# EasyEDA Pro project DCDC.eprj, board Boost
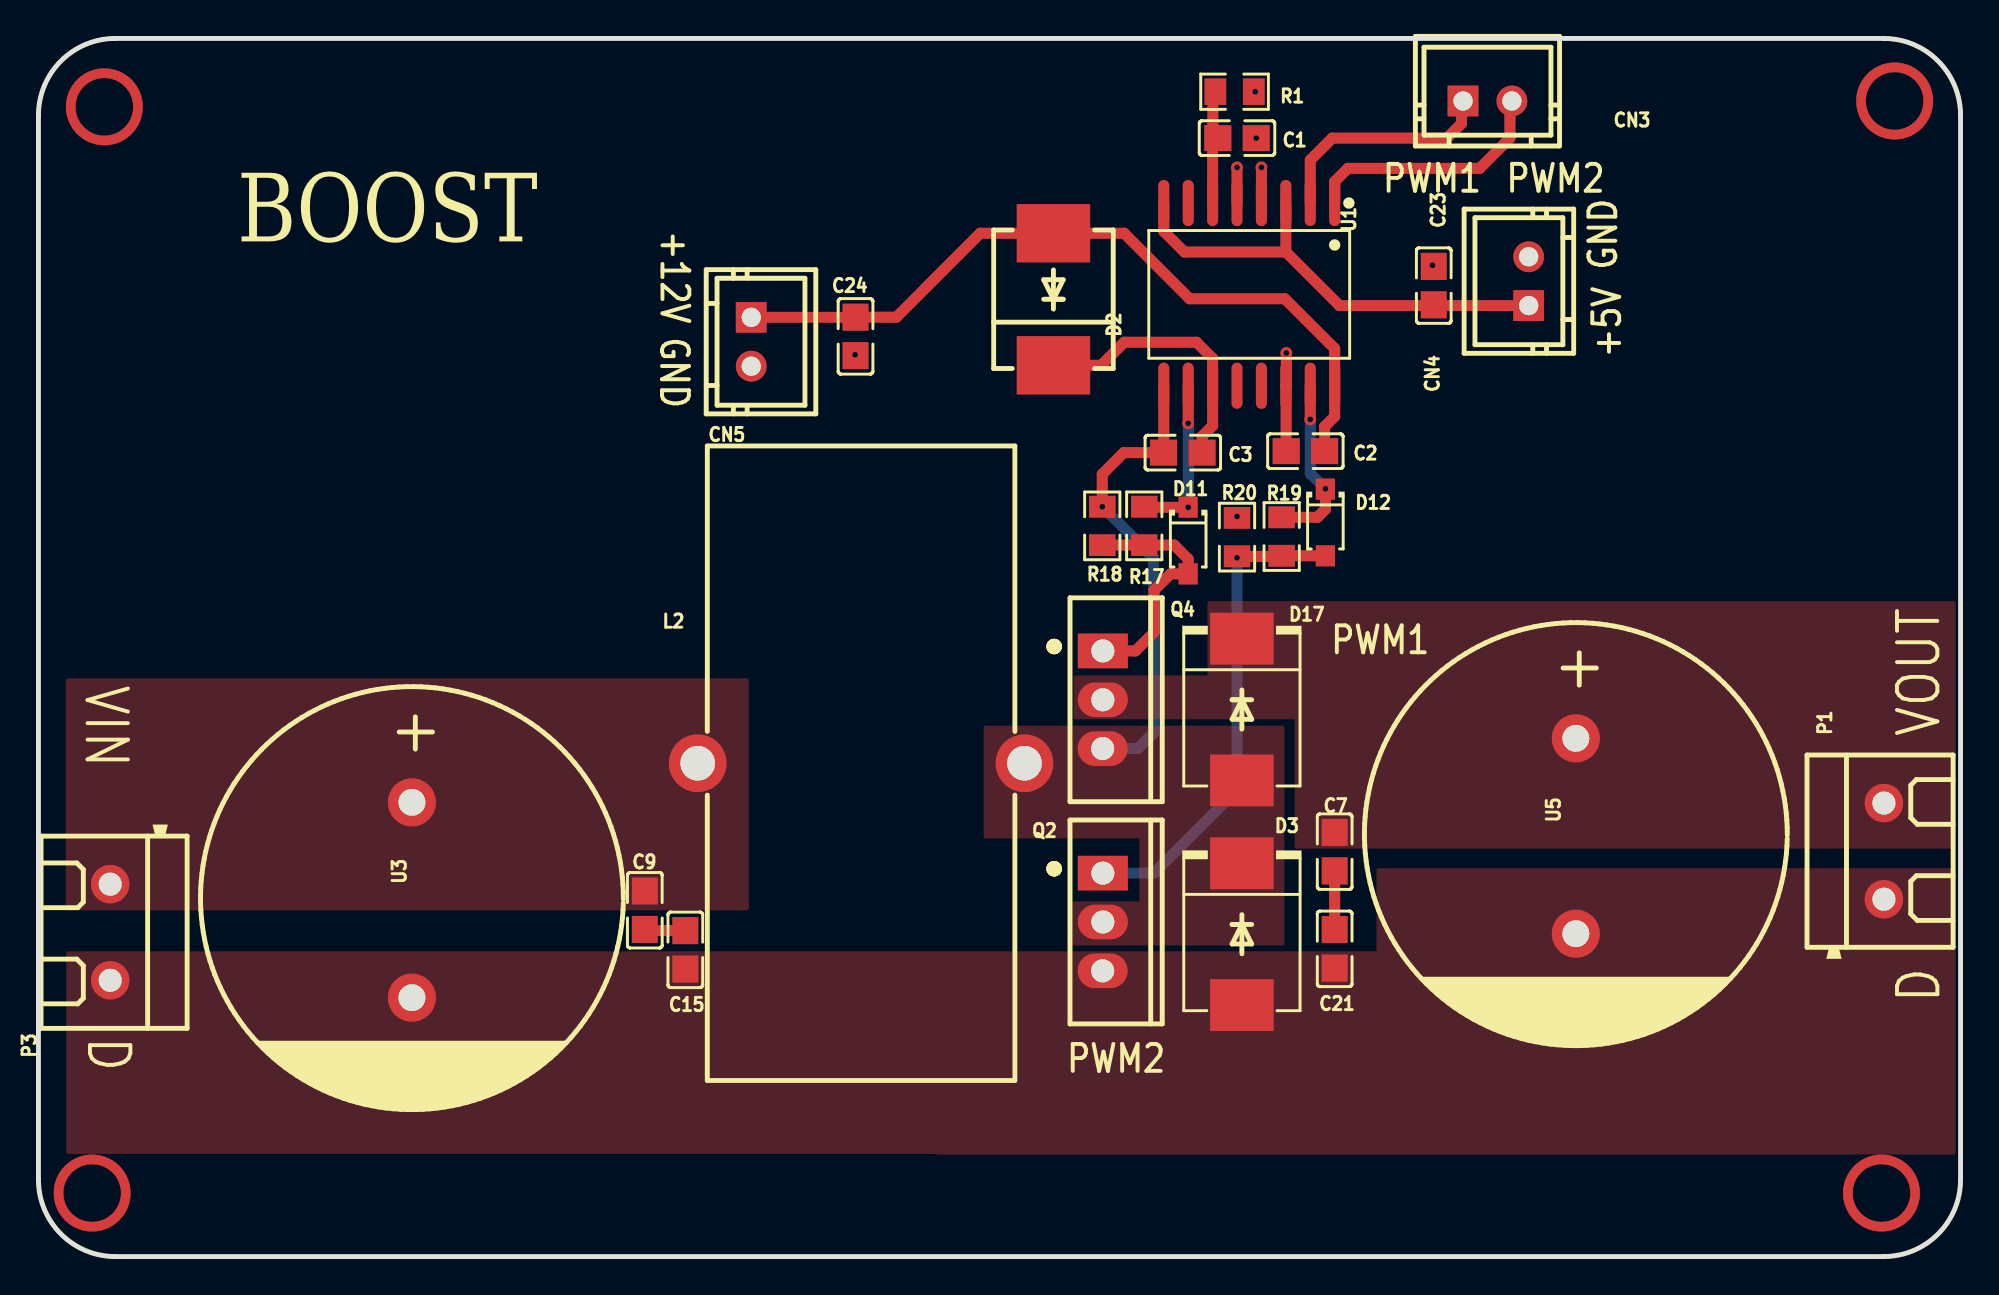
[diagram p10: board, top side]
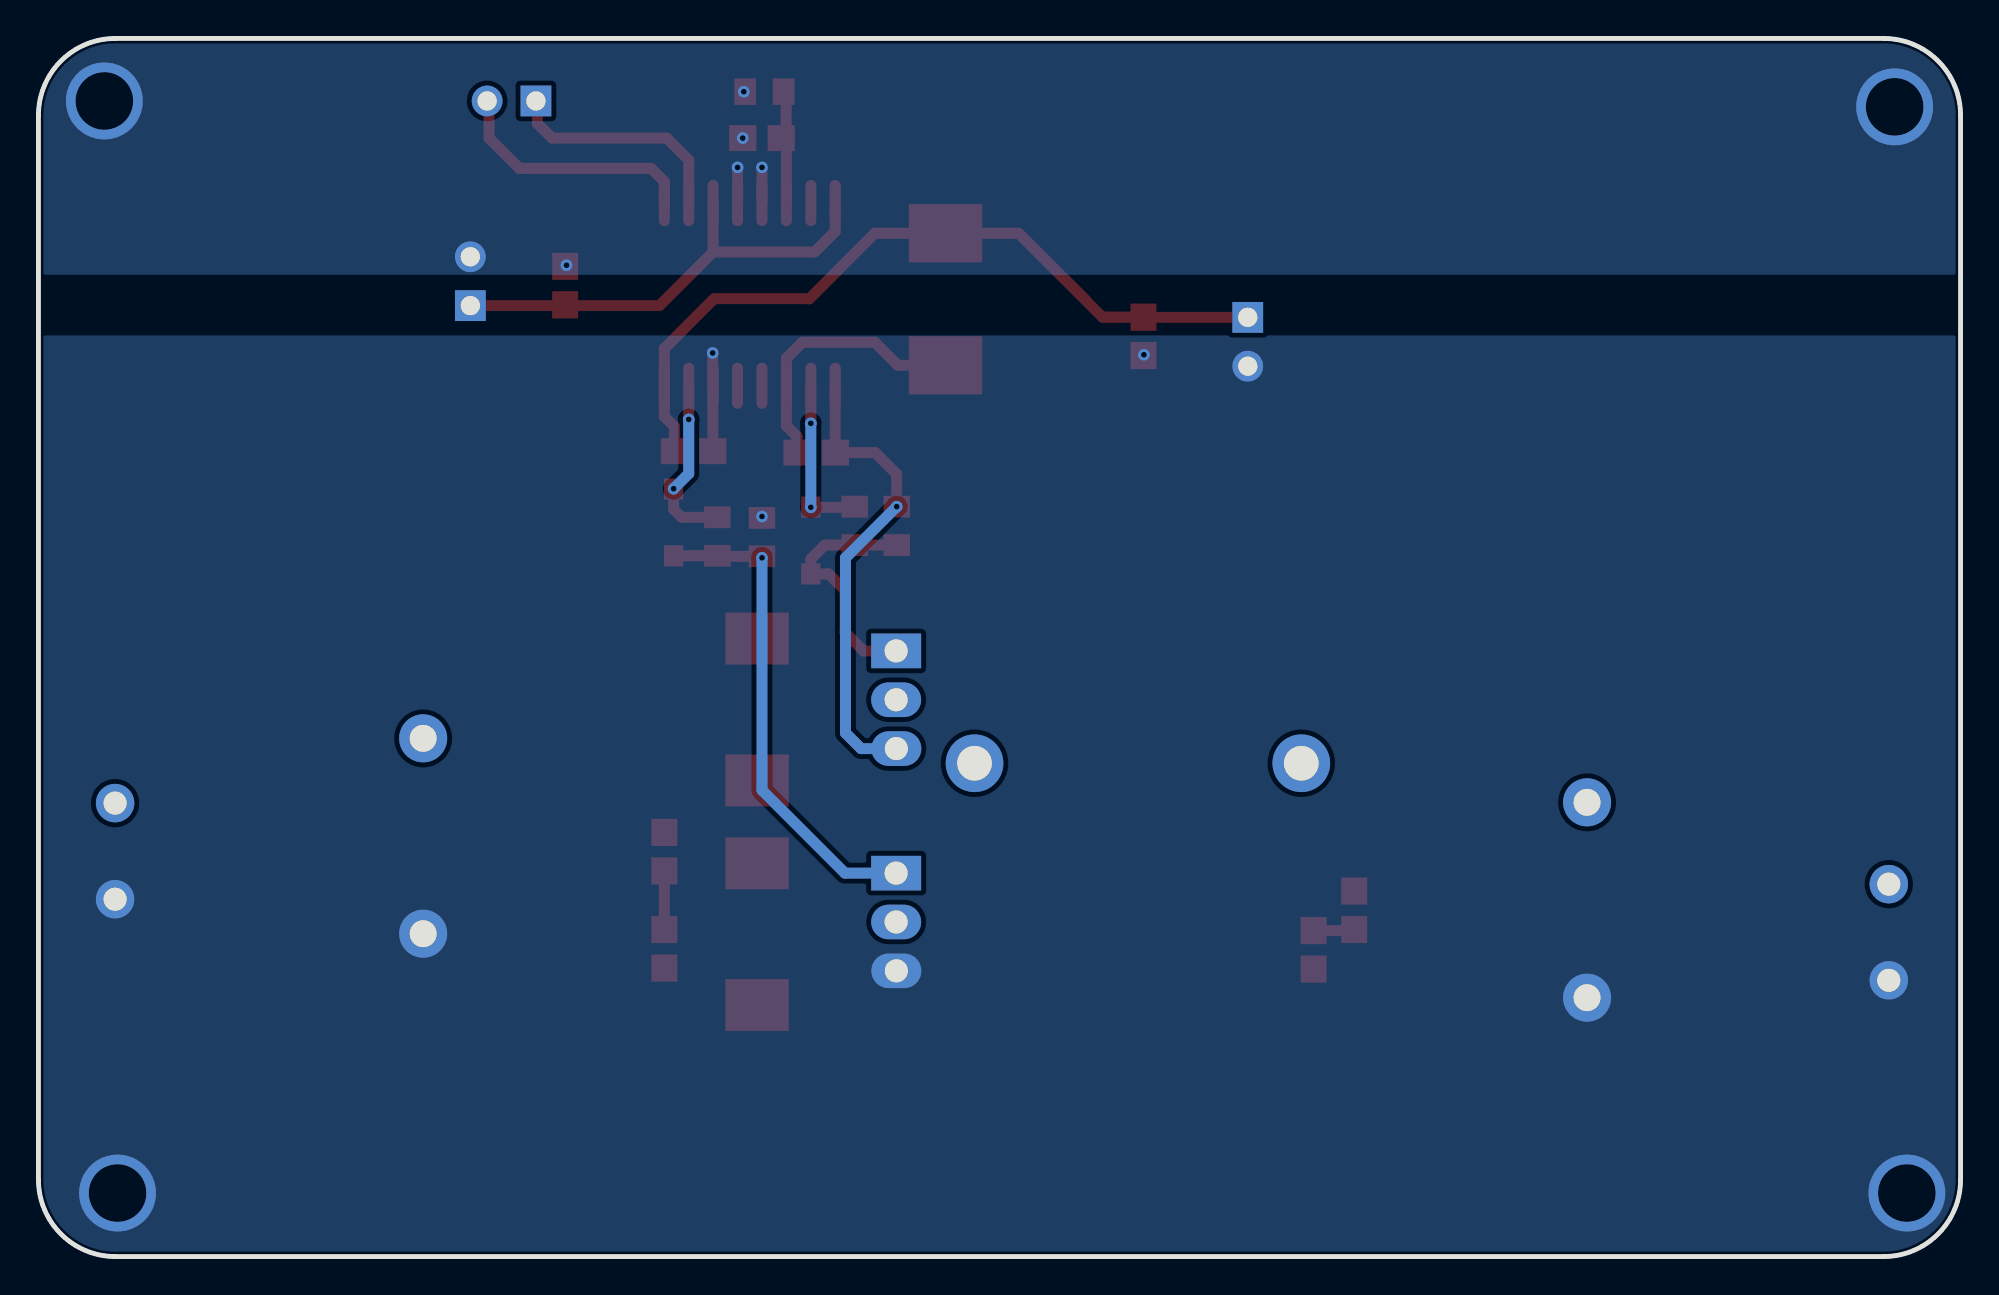
[diagram p11: board, bottom side, seen from below]

Outline 100 x 63.35 mm; copper layers: Top Layer, Bottom Layer. Coordinates in mm from the lower left corner of the outline.
Outline path: 0,59.35 0,4 arc(1.17,1.17) 4,0 96,0 arc(98.83,1.17) 100,4 100,59.35 arc(98.83,62.18) 96,63.35 4,63.35 arc(1.17,62.18) 0,59.35
Stack: Top Layer 0.035mm / Dielectric1 1.51mm FR4 er 4.5 / Bottom Layer 0.035mm

## Design rules (mm)
template: 自定义配置
spacing copperThickness1oz (default): track to track 0.102, other pairs 0.152 to 0.3
spacing copperThickness2oz: track to track 0.203, other pairs 0.152 to 0.3
track width copperThickness1oz (default): min 0.127, default 0.5, max 2.54
track width copperThickness2oz: min 0.203, default 0.254, max 2.54
differential pair differentialPair (default): width min 0.127, default 0.254, max 2.54; gap min 0.152, default 0.152
via viaSize (default): diameter min 0.5, default 0.61, max 10; hole min 0.3, default 0.305, max 6.3

## Placement (name value [footprint] x y rotation side)
C1  100nF  [C0805]  62.36 58.17 180 top
C2  1uF  [C0805]  65.91 41.88 0 top
C3  1uF  [C0805]  59.54 41.81 0 top
C7  100nF  [C0805]  67.44 21.06 90 top
C9  100nF  [C0805]  31.55 18.01 90 top
C15  100nF  [C0805]  33.66 15.95 90 top
C21  100nF  [C0805]  67.44 16 90 top
C23  10uF  [C0805]  72.59 50.49 270 top
C24  10uF  [C0805]  42.51 47.85 90 top
CN3  CON2-2.54*2P  [CONN-TH_2P-P2.54-V]  75.39 60.1 0 top
CN4  CON2-2.54*2P  [CONN-TH_2P-P2.54-V]  77.53 50.72 90 top
CN5  CON2-2.54*2P  [CONN-TH_2P-P2.54-V]  37.08 47.57 270 top
D2  RS3MC  [SMC_L7.1-W6.2-LS8.1-R-RD]  52.81 49.78 90 top
D3  SK1010C  [SMC_L6.9-W5.9-LS7.9-RD]  62.61 16.76 270 top
D11  1N4148W  [SOD-123F_L2.7-W1.6-LS3.8-RD]  59.82 37.24 270 top
D12  1N4148W  [SOD-123F_L2.7-W1.6-LS3.8-RD]  66.95 38.18 270 top
D17  SK1010C  [SMC_L6.9-W5.9-LS7.9-RD]  62.61 28.45 270 top
L2  47uH  [IND-TH_L33.0-W16.0-P17.00-D1.5]  42.8 25.65 0 top
P1  KF301-2P接线端子  [CONN-TH_XY301V-A-5.0-2P]  96.01 21.08 270 top
P3  KF301-2P接线端子  [CONN-TH_XY301V-A-5.0-2P]  3.73 16.87 90 top
Q2  CSD19536KCS  [TO-220-3_L10.0-W4.5-P2.54-L]  55.37 17.4 270 top
Q4  CSD19536KCS  [TO-220-3_L10.0-W4.5-P2.54-L]  55.37 28.96 270 top
R1  5.1K  [R0805]  62.23 60.58 180 top
R17  2  [R0805]  57.53 38 270 top
R18  10K  [R0805]  55.35 38 270 top
R19  2  [R0805]  64.68 37.44 270 top
R20  10K  [R0805]  62.36 37.41 270 top
U1  UCC21520DWR  [SOIC-16_L10.3-W7.5-P1.27-LS10.3-BL]  62.99 50.04 180 top
U3  2200uF  [CAP-TH_BD22.0-P10.00-D1.4-FD]  19.43 18.54 270 top
U5  2200uF  [CAP-TH_BD22.0-P10.00-D1.4-FD]  79.98 21.87 270 top

## Footprints (pads in the part's own frame, mm; a bottom-side part is the same pattern mirrored in y, then rotated)
C0805
  rect 1.41x1.35 smd: 1(-1,0) 2(1,0)
CAP-TH_BD22.0-P10.00-D1.4-FD
  round 2.5 hole 1.4: 1(-5.08,0) 2(5.08,0)
CONN-TH_2P-P2.54-V
  rect 1.6x1.6 hole 1: 1(-1.27,0)
  round 1.6 hole 1: 2(1.27,0)
CONN-TH_XY301V-A-5.0-2P
  round 2 hole 1.2: 1(-2.5,0) 2(2.5,0)
IND-TH_L33.0-W16.0-P17.00-D1.5
  round 3 hole 1.8: 1(-8.5,0) 2(8.5,0)
R0805
  rect 1.133x1.377 smd: 1(-1,0) 2(1,0)
SMC_L6.9-W5.9-LS7.9-RD
  rect 2.7x3.3 smd: 1(-3.687,0) 2(3.687,0)
SMC_L7.1-W6.2-LS8.1-R-RD
  rect 3.03x3.82 smd: 1(3.435,0) 2(-3.435,0)
SOD-123F_L2.7-W1.6-LS3.8-RD
  rect 1.1x1 smd: 1(-1.735,0) 2(1.735,0)
SOIC-16_L10.3-W7.5-P1.27-LS10.3-BL
  oval 0.574x2.401 smd: 1(-4.445,-4.75) 2(-3.175,-4.75) 3(-1.905,-4.75) 4(-0.635,-4.75) 5(0.635,-4.75) 6(1.905,-4.75) 7(3.175,-4.75) 8(4.445,-4.75) 9(4.445,4.75) 10(3.175,4.75) 11(1.905,4.75) 12(0.635,4.75) 13(-0.635,4.75) 14(-1.905,4.75) 15(-3.175,4.75) 16(-4.445,4.75)
TO-220-3_L10.0-W4.5-P2.54-L
  rect 1.8x2.6 hole 1.2: 1(-2.54,0.005)
  oval 1.8x2.6 hole 1.2: 2(0,0.005) 3(2.54,-0.005)

## Nets
As in the schematic.

Pads without a net: U1 7 12 13

## Via types
v1: diameter 0.61, hole 0.305, Top Layer to Bottom Layer, 14 vias
v2: diameter 4, hole 3, Top Layer to Bottom Layer, 4 vias

## Routing (per net, layer and track width the routed paths; a pad name or vN(x,y) marks a point on that pad's centre or on a via; arc(x,y) is an arc through that point)
+5V: length 24.6
  Top Layer w0.571: 64.9,52.24 59.62,52.24 58.55,53.31 U1.8 ; 64.9,52.24 U1.3 ; 64.9,52.24 67.69,49.45 77.48,49.45 77.53,49.5
+12V: length 40.2
  Top Layer w0.571: C2.2 66.91,43.16 67.44,43.69 U1.16 67.44,47.22 64.85,49.81 59.89,49.81 56.48,53.22 D2.1 49,53.22 44.64,48.85 C24.2 42.5,48.84 CN5.1
AGND: length 5.1
  Top Layer w0.571: C2.1 64.91,45.27 U1.14 64.92,45.31 v1(64.92,46.99)
  vias: v1(42.49,46.9) v1(62.36,38.49) v2(2.79,3.3) v2(95.89,3.3)
DGND: length 3.7
  Top Layer w0.571: U1.5 v1(62.36,56.64) ; U1.4 v1(63.63,56.64)
  vias: v1(63.3,60.58) v1(63.36,58.17) v1(72.53,51.55) v2(3.43,59.79) v2(96.57,60.1)
VSS: length 24.8
  Top Layer w0.571: U1.9 58.55,41.82 C3.1 56.46,41.81 55.35,40.69 v1(55.35,39) ; 62.61,24.89 D17.2
  Bottom Layer w0.571: v1(55.35,39) 58.01,36.33 58.01,27.23 57.2,26.42 Q4.3
H: length 12.9
  Top Layer w0.571: Q4.1 57.07,31.5 58.04,32.46 58.04,34.65 58.89,35.5 D11.2 59.82,36.27 59.09,37 R17.2 R18.2
HO: length 8.8
  Top Layer w0.571: U1.10 v1(59.82,43.33) ; 57.4,39 57.44,38.96 v1(59.82,38.96)
  Bottom Layer w0.571: v1(59.82,43.33) v1(59.82,38.96)
L: length 25.5
  Top Layer w0.571: R20.2 64.65,36.41 R19.2 66.95,36.44 66.95,36.44
  Bottom Layer w0.571: Q2.1 58.04,19.94 62.36,24.26 v1(62.36,36.34)
LO: length 9.2
  Top Layer w0.571: R19.1 66.54,38.44 66.95,38.86 D12.1 ; U1.15 v1(66.17,43.54)
  Bottom Layer w0.571: v1(66.95,39.93) 66.17,40.72 v1(66.17,43.54)
PWM1: length 12
  Top Layer w0.571: 74.04,60.07 74.04,58.93 73.28,58.17 67.31,58.17 66.17,57.02 U1.2
PWM2: length 13.1
  Top Layer w0.571: 76.58,60.07 76.56,60.05 76.56,58.17 74.98,56.59 68.12,56.59 67.44,55.91 U1.1
$1N383: length 6.1
  Top Layer w0.571: U1.6 61.09,57.9 C1.2 61.1,58.42 61.1,60.32 61.36,60.58
$1N415: length 14.3
  Top Layer w0.571: D2.2 55.29,46.35 56.49,47.55 60.25,47.55 61.09,46.71 U1.11 61.09,43.21 60.54,42.66 C3.2
$1N4346: length 2.1
  Top Layer w0.571: C15.2 31.6,16.95 C9.1
$1N5100: length 3.1
  Top Layer w0.571: C7.1 C21.2

## Copper pours and planes (outline as drawn; the poured copper is in the pictures)
AGND on Top Layer: 46.69,5.31 46.69,5.33 1.45,5.33 1.45,15.88 69.61,15.88 69.61,20.19 100.71,20.19 100.71,5.31
AGND on Bottom Layer: -0.79,47.9 100.61,47.9 100.61,-0.69 -0.79,-0.69
DGND on Bottom Layer: -0.51,64.8 100.64,64.8 100.64,51.05 -0.51,51.05
VIN on Top Layer: 1.42,18.01 36.96,18.01 36.96,30.07 1.42,30.07
VSS on Top Layer: 49.17,27.61 64.82,27.61 64.82,16.18 53.62,16.18 53.62,18.47 57.27,18.47 57.27,21.74 49.17,21.74
VOUT on Top Layer: 53.85,27.94 65.36,27.94 65.36,21.21 101.15,21.21 101.15,34.09 60.82,34.09 60.82,30.23 53.85,30.23

## Text on the board
Top Silkscreen Layer: PWM2 | PWM1 | GND | +5V | +12V | VOUT | D | VIN | BOOST
